# EasyEDA Pro project Breakout Board 28 pin.eprj

# Schematic Schematic1
Board Name: Board1; Create Date: 2026-04-29; Page Name: P1; Project Name: Breakout Board 28 pin; Schematic Name: Schematic1; Update Date: 2026-04-29; Company: EasyEDA.com; Page Size: A4; Version: V1.0
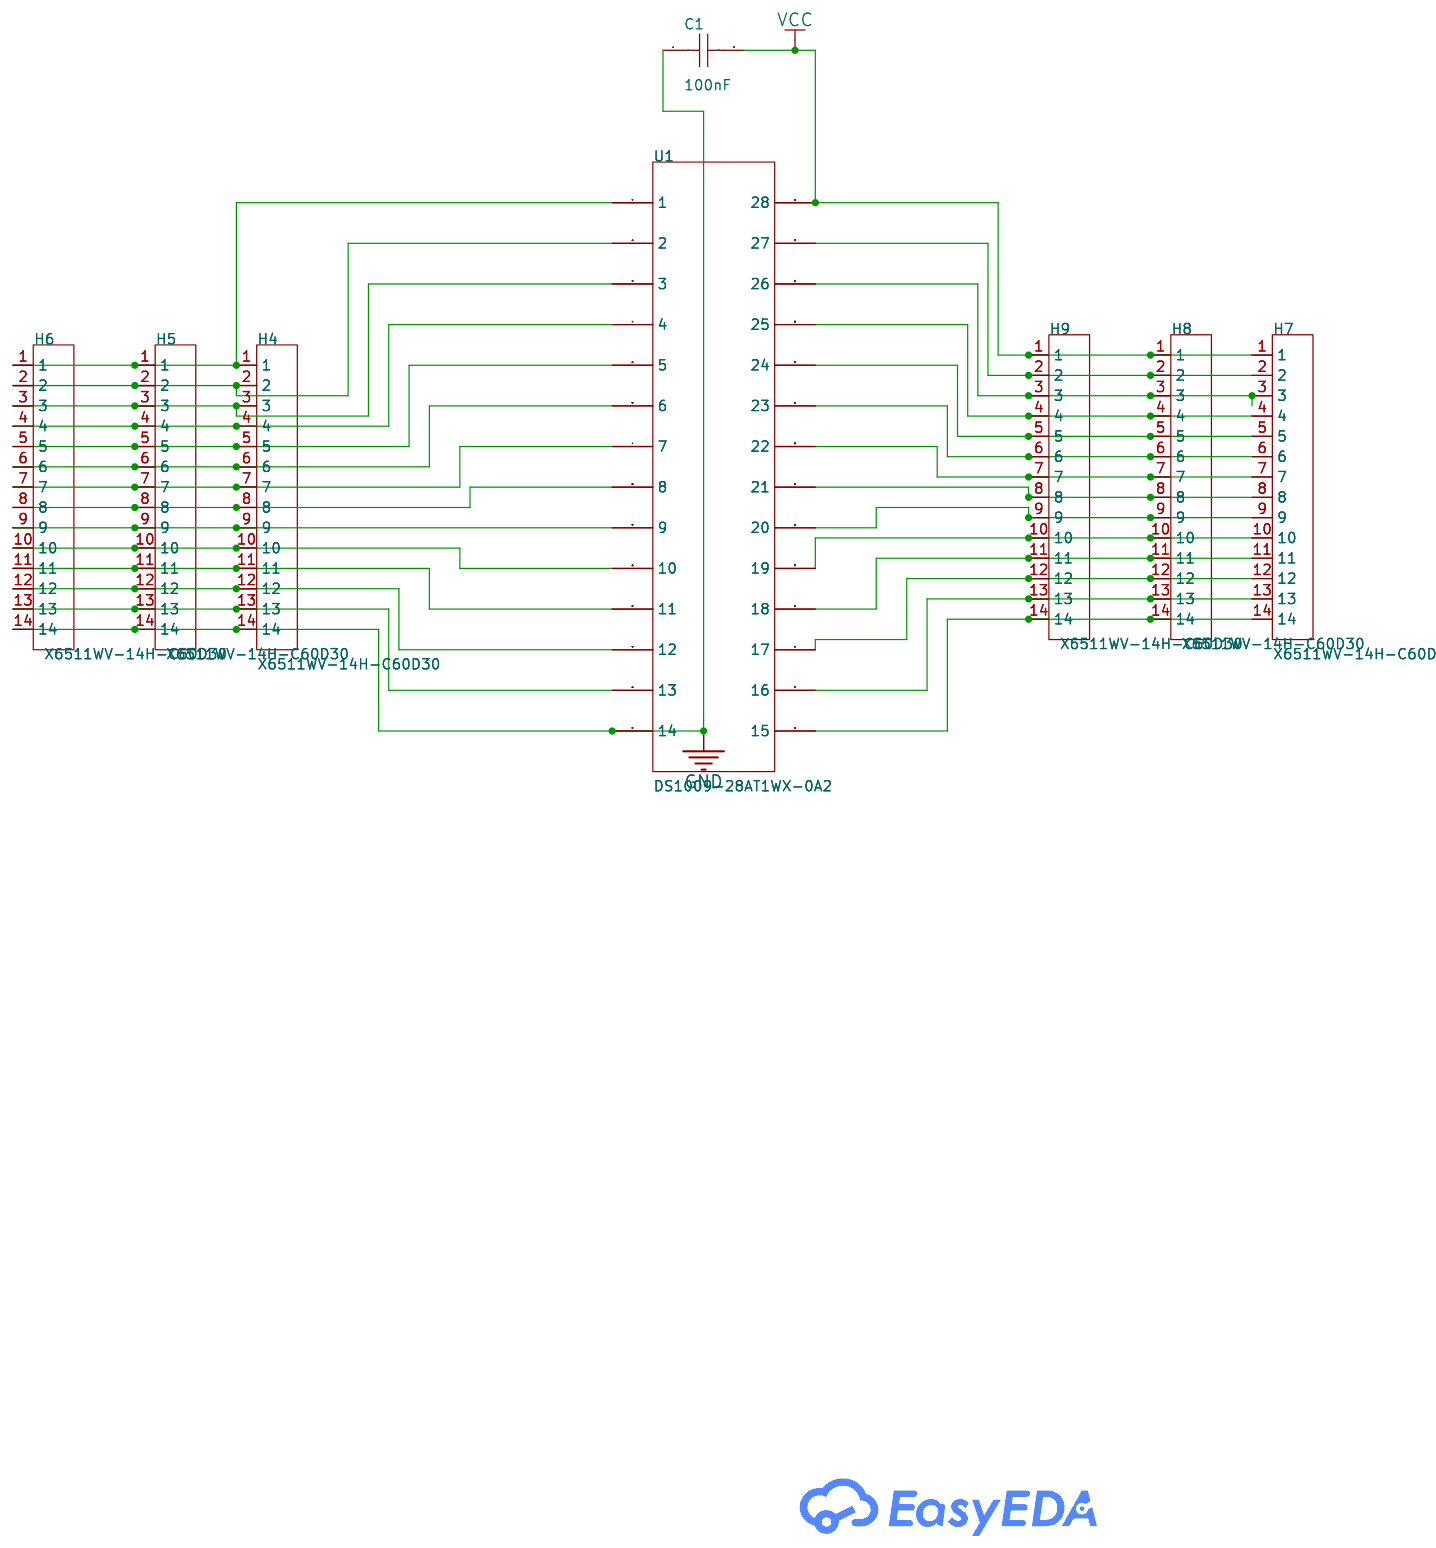
[diagram p0: schematic sheet]

## Parts
C1  100nF  [CAP-TH_L8.5-W5.0-P5.00-D1.2]
H4  X6511WV-14H-C60D30  [HDR-TH_14P-P2.54-V-M]
H5  X6511WV-14H-C60D30  [HDR-TH_14P-P2.54-V-M]
H6  X6511WV-14H-C60D30  [HDR-TH_14P-P2.54-V-M]
H7  X6511WV-14H-C60D30  [HDR-TH_14P-P2.54-V-M]
H8  X6511WV-14H-C60D30  [HDR-TH_14P-P2.54-V-M]
H9  X6511WV-14H-C60D30  [HDR-TH_14P-P2.54-V-M]
U1  DS1009-28AT1WX-0A2  [DIP-28_L35.6-W17.8-P2.54-LS15.2-BL]

## Library data of the parts
C1 = CT4-0805B104K500F3: LCSC Part Name: C3型（直脚） 100nF ±10% 50V; Supplier Part: C84772; Manufacturer: FH(风华); Supplier Footprint: 插件,P=5.08mm; JLCPCB Part Class: Extended Part; Datasheet: https://item.szlcsc.com/datasheet/CT4-0805B104K500F3/85943.html; Supplier: LCSC; Tolerance: ±10%; Voltage Rating: 50V; Temperature Coefficient: X7R; Pin Spacing: 5.08mm
H4-H9 = X6511WV-14H-C60D30: LCSC Part Name: 1x14P 间距:2.54mm 方针; Supplier Part: C725946; Manufacturer: XKB Connection(中国星坤); Supplier Footprint: 插件,P=2.54mm; JLCPCB Part Class: Extended Part; Datasheet: https://item.szlcsc.com/datasheet/X6511WV-14H-C60D30/772395.html; Supplier: LCSC; Pin Structure: 1x14P; Pitch: 2.54mm; Row Spacing: 2.54mm; Circluar Pins/Square Pins: Pin Header; Number of Rows: 1; Number of Pins: 14P; Current Rating: 3A; Voltage Rating (Max): 250V; Insulation Height: 2.5mm; Contact Material: Brass; Contact Plating: Gold; Operating Temperature: -40℃~+105℃; Color: Black
U1 = DS1009-28AT1WX-0A2: LCSC Part Name: 间距2.54mm 方孔 P数:28P; Supplier Part: C72121; Manufacturer: CONNFLY; Supplier Footprint: DIP-28; JLCPCB Part Class: Extended Part; Datasheet: https://item.szlcsc.com/datasheet/DS1009-28AT1WX-0A2/73230.html; Supplier: LCSC; Adaptation Package Type: DIP; Pitch: 2.54mm; Row Spacing: 15.24mm; Circular Holes/Square Holes: Square Hole; Number of Positions: 28P; Contact Plating: Tin; Operating Temperature: -20℃~+105℃

## Nets
GND: C1.1 H4.14 H5.14 H6.14 U1.14
VCC: C1.2 H7.1 H8.1 H9.1 U1.28
$1N935: H4.1 H5.1 H6.1 U1.1
$1N953: H4.2 H5.2 H6.2 U1.2
$1N958: H4.3 H5.3 H6.3 U1.3
$1N963: H4.4 H5.4 H6.4 U1.4
$1N968: H4.5 H5.5 H6.5 U1.5
$1N973: H4.6 H5.6 H6.6 U1.6
$1N978: H4.7 H5.7 H6.7 U1.7
$1N983: H4.8 H5.8 H6.8 U1.8
$1N988: H4.9 H5.9 H6.9 U1.9
$1N1134: H4.11 H5.11 H6.11 U1.11
$1N1140: H4.10 H5.10 H6.10 U1.10
$1N1170: H4.12 H5.12 H6.12 U1.12
$1N1174: H4.13 H5.13 H6.13 U1.13
$1N1612: H7.2 H8.2 H9.2 U1.27
$1N1616: H7.3 H8.3 H9.3 U1.26
$1N1620: H7.4 H8.4 H9.4 U1.25
$1N1623: H7.5 H8.5 H9.5 U1.24
$1N1626: H7.6 H8.6 H9.6 U1.23
$1N1629: H7.7 H8.7 H9.7 U1.22
$1N1632: H7.8 H8.8 H9.8 U1.21
$1N1635: H7.9 H8.9 H9.9 U1.20
$1N1638: H7.14 H8.14 H9.14 U1.15
$1N1641: H7.11 H8.11 H9.11 U1.18
$1N1644: H7.10 H8.10 H9.10 U1.19
$1N1647: H7.12 H8.12 H9.12 U1.17
$1N1650: H7.13 H8.13 H9.13 U1.16

# Board PCB1
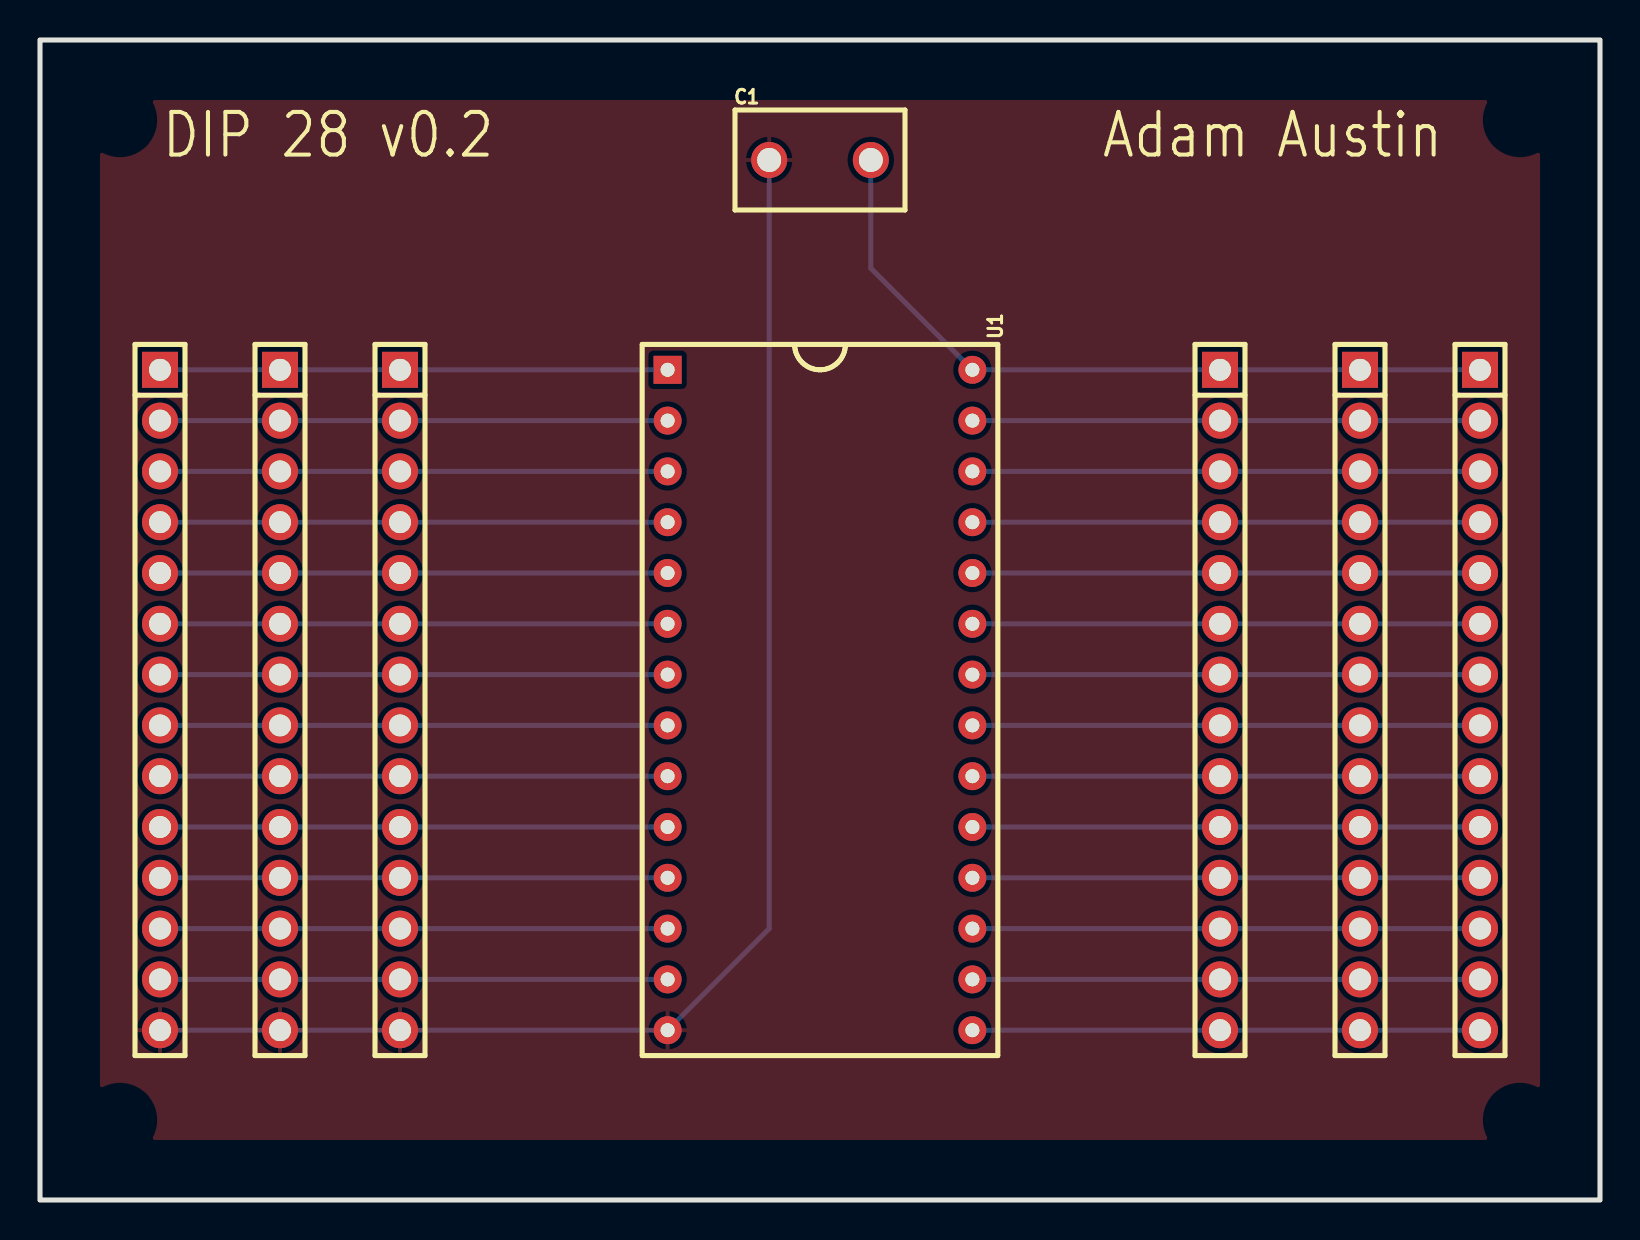
[diagram p1: board, top side]
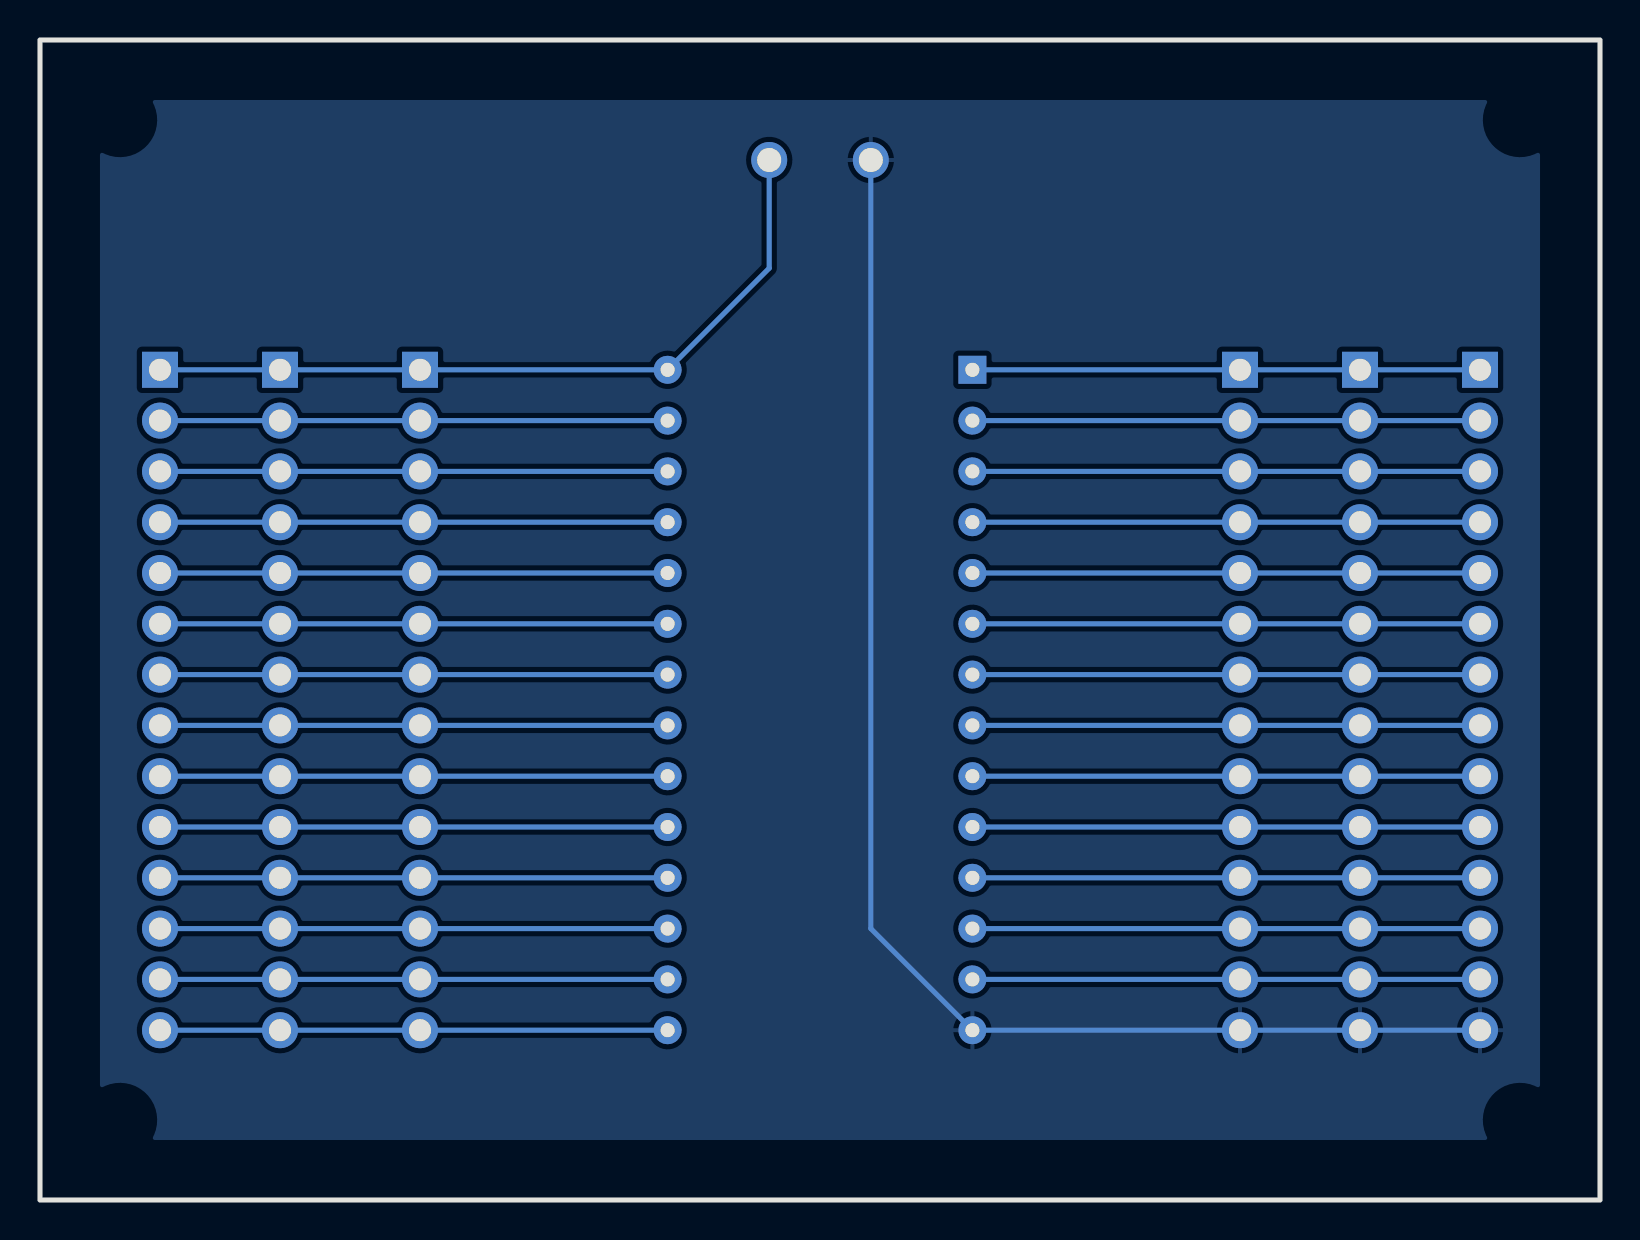
[diagram p2: board, bottom side, seen from below]

Outline 78 x 58 mm; copper layers: Top Layer, Bottom Layer. Coordinates in mm from the lower left corner of the outline.
Outline path: rectangle 0,58 78,0
Stack: Top Layer 0.035mm / Dielectric1 1.51mm FR4 er 4.5 / Bottom Layer 0.035mm

## Design rules (mm)
template: JLCPCB Capability(Two Layers Board)
spacing copperThickness1oz (default): track to track 0.102, other pairs 0.152 to 0.3
spacing copperThickness2oz: track to track 0.203, other pairs 0.152 to 0.3
track width copperThickness1oz (default): min 0.127, default 0.254, max 2.54
track width copperThickness2oz: min 0.203, default 0.254, max 2.54
differential pair differentialPair (default): width min 0.127, default 0.254, max 2.54; gap min 0.152, default 0.152
via viaSize (default): diameter min 0.5, default 0.61, max 10; hole min 0.3, default 0.305, max 6.3

## Placement (name value [footprint] x y rotation side)
C1  100nF  [CAP-TH_L8.5-W5.0-P5.00-D1.2]  39 52 0 top
H4  X6511WV-14H-C60D30  [HDR-TH_14P-P2.54-V-M]  18 25 270 top
H5  X6511WV-14H-C60D30  [HDR-TH_14P-P2.54-V-M]  12 25 270 top
H6  X6511WV-14H-C60D30  [HDR-TH_14P-P2.54-V-M]  6 25 270 top
H7  X6511WV-14H-C60D30  [HDR-TH_14P-P2.54-V-M]  72 25 270 top
H8  X6511WV-14H-C60D30  [HDR-TH_14P-P2.54-V-M]  66 25 270 top
H9  X6511WV-14H-C60D30  [HDR-TH_14P-P2.54-V-M]  59 25 270 top
U1  DS1009-28AT1WX-0A2  [DIP-28_L35.6-W17.8-P2.54-LS15.2-BL]  39 25 270 top

## Footprints (pads in the part's own frame, mm; a bottom-side part is the same pattern mirrored in y, then rotated)
CAP-TH_L8.5-W5.0-P5.00-D1.2
  round 1.8 hole 1.2: 1(-2.54,0) 2(2.54,0)
DIP-28_L35.6-W17.8-P2.54-LS15.2-BL
  rect 1.4x1.4 hole 0.7: 1(-16.51,-7.62)
  round 1.4 hole 0.7: 2(-13.97,-7.62) 3(-11.43,-7.62) 4(-8.89,-7.62) 5(-6.35,-7.62) 6(-3.81,-7.62) 7(-1.27,-7.62) 8(1.27,-7.62) 9(3.81,-7.62) 10(6.35,-7.62) 11(8.89,-7.62) 12(11.43,-7.62) 13(13.97,-7.62) 14(16.51,-7.62) 15(16.51,7.62) 16(13.97,7.62) 17(11.43,7.62) 18(8.89,7.62) 19(6.35,7.62) 20(3.81,7.62) 21(1.27,7.62) 22(-1.268,7.62) 23(-3.81,7.62) 24(-6.35,7.62) 25(-8.89,7.62) 26(-11.43,7.62) 27(-13.97,7.62) 28(-16.51,7.62)
HDR-TH_14P-P2.54-V-M
  rect 1.8x1.8 hole 1.1: 1(-16.51,0)
  round 1.8 hole 1.1: 2(-13.97,0) 3(-11.43,0) 4(-8.89,0) 5(-6.35,0) 6(-3.81,0) 7(-1.27,0) 8(1.27,0) 9(3.81,0) 10(6.35,0) 11(8.89,0) 12(11.43,0) 13(13.97,0) 14(16.51,0)

## Nets
As in the schematic.

## Routing (per net, layer and track width the routed paths; a pad name or vN(x,y) marks a point on that pad's centre or on a via; arc(x,y) is an arc through that point)
GND: length 71
  Bottom Layer w0.254: C1.1 36.46,13.57 U1.14 H4.14 H5.14 H6.14
VCC: length 38
  Bottom Layer w0.254: C1.2 41.54,46.59 U1.28 H9.1 H8.1 H7.1
$1N935: length 25.4
  Bottom Layer w0.254: U1.1 H4.1 H5.1 H6.1
$1N953: length 25.4
  Bottom Layer w0.254: U1.2 H4.2 H5.2 H6.2
$1N958: length 25.4
  Bottom Layer w0.254: U1.3 H4.3 H5.3 H6.3
$1N963: length 25.4
  Bottom Layer w0.254: H6.4 H5.4 H4.4 U1.4
$1N968: length 25.4
  Bottom Layer w0.254: H6.5 H5.5 H4.5 U1.5
$1N973: length 25.4
  Bottom Layer w0.254: U1.6 H4.6 H5.6 H6.6
$1N978: length 25.4
  Bottom Layer w0.254: U1.7 H4.7 H5.7 H6.7
$1N983: length 25.4
  Bottom Layer w0.254: H6.8 H5.8 H4.8 U1.8
$1N988: length 25.4
  Bottom Layer w0.254: H6.9 H5.9 H4.9 U1.9
$1N1134: length 25.4
  Bottom Layer w0.254: H6.11 H5.11 H4.11 U1.11
$1N1140: length 25.4
  Bottom Layer w0.254: H6.10 H5.10 H4.10 U1.10
$1N1170: length 25.4
  Bottom Layer w0.254: H6.12 H5.12 H4.12 U1.12
$1N1174: length 25.4
  Bottom Layer w0.254: H6.13 H5.13 H4.13 U1.13
$1N1612: length 25.4
  Bottom Layer w0.254: H7.2 H8.2 H9.2 U1.27
$1N1616: length 25.4
  Bottom Layer w0.254: U1.26 H9.3 H8.3 H7.3
$1N1620: length 25.4
  Bottom Layer w0.254: H7.4 H8.4 H9.4 U1.25
$1N1623: length 25.4
  Bottom Layer w0.254: U1.24 H9.5 H8.5 H7.5
$1N1626: length 25.4
  Bottom Layer w0.254: U1.23 H9.6 H8.6 H7.6
$1N1629: length 25.4
  Bottom Layer w0.254: 46.62,26.27 H9.7 H8.7 H7.7
$1N1632: length 25.4
  Bottom Layer w0.254: H7.8 H8.8 H9.8 U1.21
$1N1635: length 25.4
  Bottom Layer w0.254: U1.20 H9.9 H8.9 H7.9
$1N1638: length 25.4
  Bottom Layer w0.254: H7.14 H8.14 H9.14 U1.15
$1N1641: length 25.4
  Bottom Layer w0.254: H7.11 H8.11 H9.11 U1.18
$1N1644: length 25.4
  Bottom Layer w0.254: U1.19 H9.10 H8.10 H7.10
$1N1647: length 25.4
  Bottom Layer w0.254: U1.17 H9.12 H8.12 H7.12
$1N1650: length 25.4
  Bottom Layer w0.254: H7.13 H8.13 H9.13 U1.16

## Copper pours and planes (outline as drawn; the poured copper is in the pictures)
GND on Top Layer: 3,55 75,55 75,3 3,3
GND on Bottom Layer: 3,55 75,55 75,3 3,3

## Text on the board
Top Silkscreen Layer: DIP 28 v0.2 | Adam Austin
